# EAGLE design OLIMEXINO-85BC_Rev_A (EAGLE 6.4)
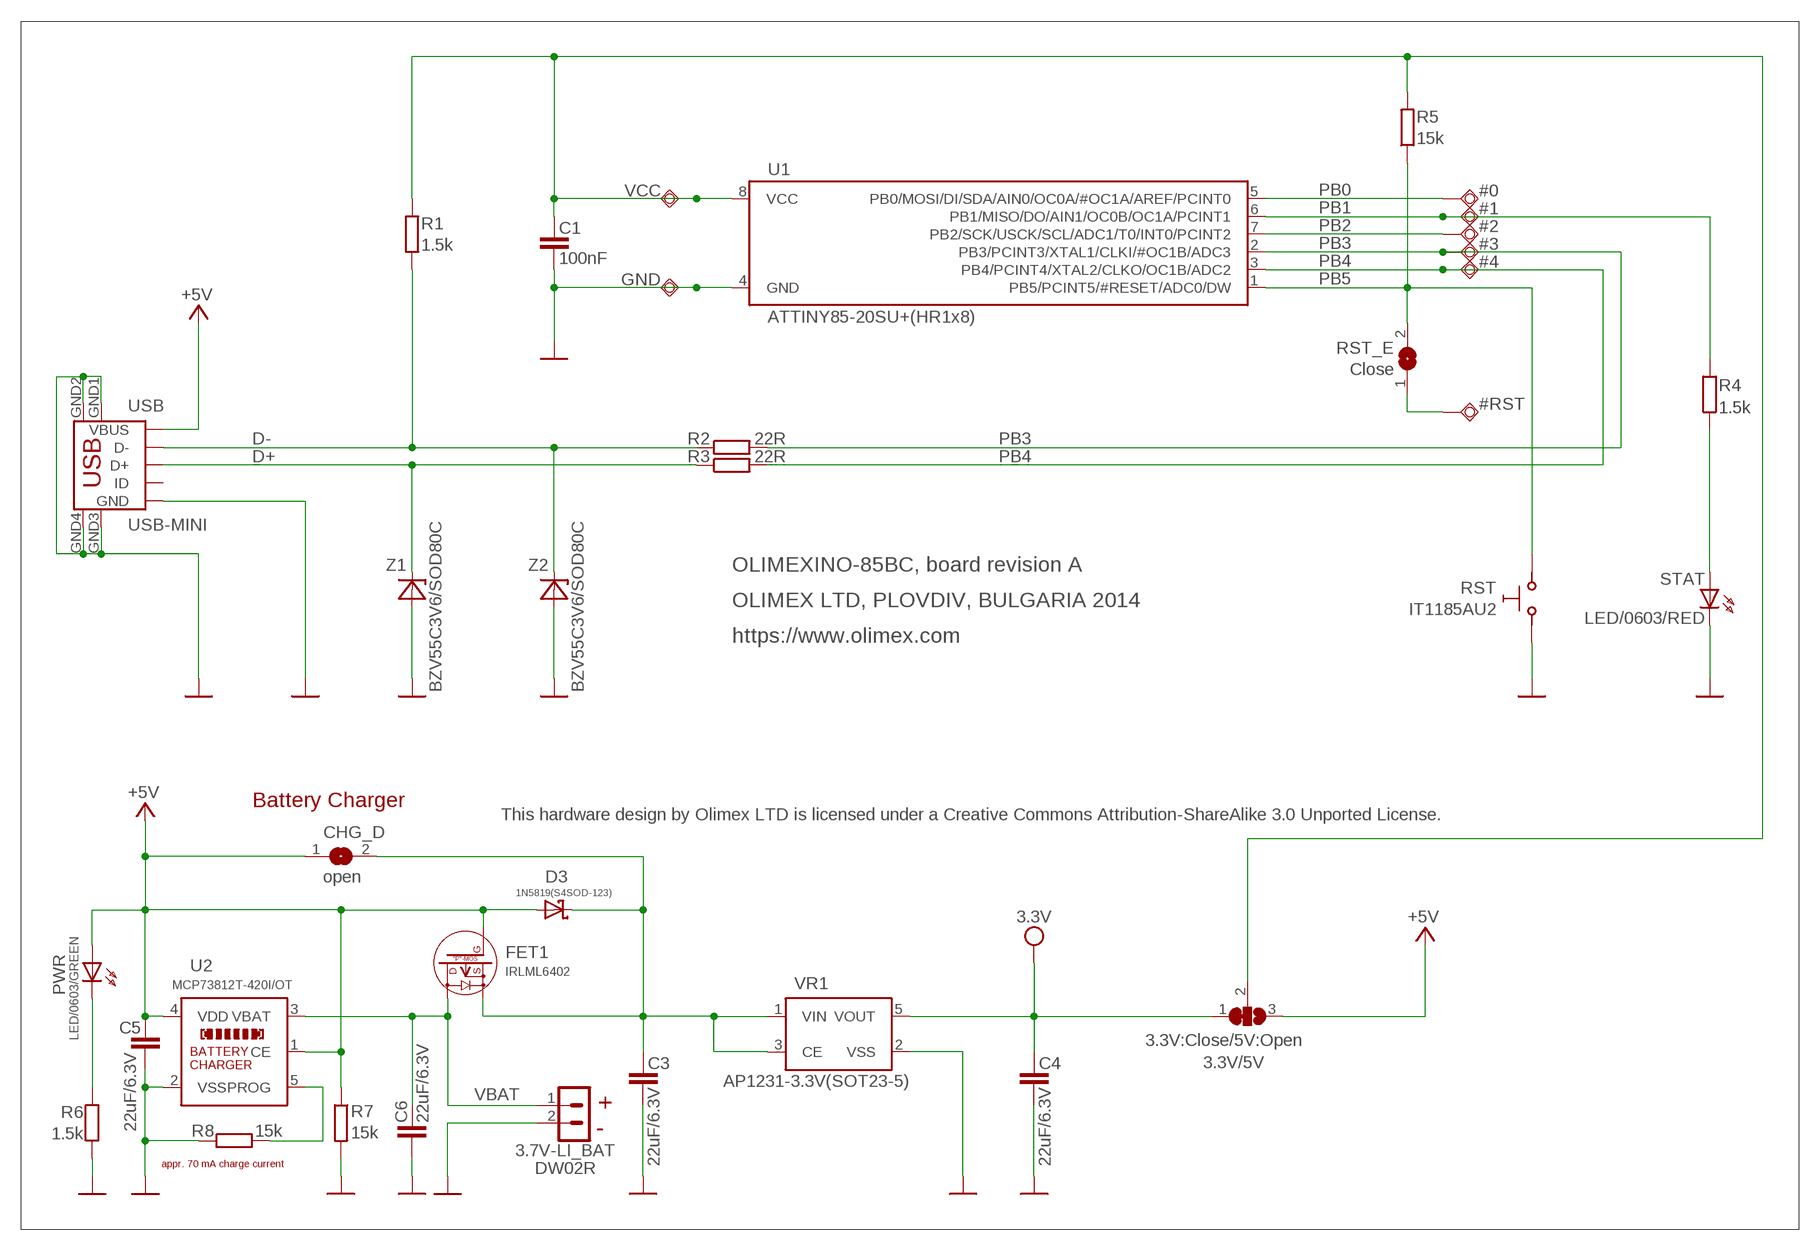
[diagram p0: schematic, sheet 1]

## Parts
3.3V/5V  3.3V:Close/5V:Open  SJ2W3  [SJ_2_SMALL]
3.7V-LI_BAT  DW02R  CON2DW02R  [DW02R]
#0  TESTPAD3  [TEST_PAD40/70/SQUARE]
#1  TESTPAD3  [TEST_PAD40/70/SQUARE]
#2  TESTPAD3  [TEST_PAD40/70/SQUARE]
#3  TESTPAD3  [TEST_PAD40/70/SQUARE]
#4  TESTPAD3  [TEST_PAD40/70/SQUARE]
#RST  TESTPAD3  [TEST_PAD40/70/SQUARE]
C1  100nF  C-EUC0603_DWS  [C0603_DWS]
C3  22uF/6.3V  C-EUC0603_DWS  [C0603_DWS]
C4  22uF/6.3V  C-EUC0603_DWS  [C0603_DWS]
C5  22uF/6.3V  C-EUC0603_DWS  [C0603_DWS]
C6  22uF/6.3V  C-EUC0603_DWS  [C0603_DWS]
CHG_D  open  SJSJ_SMALLER  [SJ_1_SMALLER]
D3  1N5819(S4SOD-123)  SCHOTKKY7.62SS-1N5819(S4SOD-123)  [SOD-123]
FET1  IRLML6402  P-MOS+DIODIRLML6402  [SOT23]
GND  TESTPAD3  [TEST_PAD40/70/SQUARE]
PWR  LED/0603/GREEN  LED0603DWS  [LED-0603]
R1  1.5k  R-EU_R0603_5MIL_DWS  [R0603_5MIL_DWS]
R2  22R  R-EU_R0603_5MIL_DWS  [R0603_5MIL_DWS]
R3  22R  R-EU_R0603_5MIL_DWS  [R0603_5MIL_DWS]
R4  1.5k  R-EU_R0603_5MIL_DWS  [R0603_5MIL_DWS]
R5  15k  R-EU_R0603_5MIL_DWS  [R0603_5MIL_DWS]
R6  1.5k  R-EU_R0603_5MIL_DWS  [R0603_5MIL_DWS]
R7  15k  R-EU_R0603_5MIL_DWS  [R0603_5MIL_DWS]
R8  15k  R-EU_R0603_5MIL_DWS  [R0603_5MIL_DWS]
RST  IT1185AU2  SW-TAKTIT1185AU2  [IT1185AU2]
RST_E  Close  SJSJ_SMALLER  [SJ_1_SMALLER]
STAT  LED/0603/RED  LED0603DWS  [LED-0603]
U1  ATTINY85-20SU+(HR1x8)  ATTINY85-20SU  [SO-8]
U2  MCP73812T-420I/OT  MCP7381XSOT-23-5  [SOT-23-5]
USB  USB-MINI  MINI_USB9  [USB_MINI_9PIN]
VCC  TESTPAD3  [TEST_PAD40/70/SQUARE]
VR1  AP1231-3.3V(SOT23-5)  AP1231-33  [SOT-23-5]
Z1  BZV55C3V6/SOD80C  ZDIOD-SMD  [MINI-MELF]
Z2  BZV55C3V6/SOD80C  ZDIOD-SMD  [MINI-MELF]

## Nets
+5V: 3.3V/5V.3 C5.1 CHG_D.1 D3.A FET1.1(G) PWR.A R7.1 U2.1(CE) U2.4(VDD) USB.VBUS
D+: R3.1 USB.D+ Z1.1(C)
D-: R1.1 R2.1 USB.D- Z2.1(C)
GND [pwr]: 3.7V-LI_BAT.2 C1.2 C3.2 C4.2 C5.2 C6.2 GND.P$1(PP) R6.2 R7.2 R8.1 RST.2 STAT.C U1.4(GND) U2.2(VSS) USB.GND USB.GND1 USB.GND2 USB.GND3 USB.GND4 VR1.2(VSS) Z1.2(A) Z2.2(A)
MCU_VCC [pwr]: 3.3V/5V.2 C1.1 R1.2 R5.2 U1.8(VCC) VCC.P$1(PP)
N$1: #RST.P$1(PP) RST_E.1
N$4: R4.1 STAT.A
N$21: PWR.C R6.1
N$22: R8.2 U2.5(PROG)
PB0: #0.P$1(PP) U1.5(PB0/MOSI/DI/SDA/AIN0/OC0A/#OC1A/AREF/PCINT0)
PB1: #1.P$1(PP) R4.2 U1.6(PB1/MISO/DO/AIN1/OC0B/OC1A/PCINT1)
PB2: #2.P$1(PP) U1.7(PB2/SCK/USCK/SCL/ADC1/T0/INT0/PCINT2)
PB3: #3.P$1(PP) R2.2 U1.2(PB3/PCINT3/XTAL1/CLKI/#OC1B/ADC3)
PB4: #4.P$1(PP) R3.2 U1.3(PB4/PCINT4/XTAL2/CLKO/OC1B/ADC2)
PB5: R5.1 RST.1 RST_E.2 U1.1(PB5/PCINT5/#RESET/ADC0/DW)
VBAT: 3.7V-LI_BAT.1 C6.1 FET1.3(D) U2.3(VBAT)
VCC [pwr]: 3.3V/5V.1 C4.1 VR1.5(VOUT) ; supply symbol labelled 3.3V
VIN: C3.1 CHG_D.2 D3.C FET1.2(S) VR1.1(VIN) VR1.3(CE)
Unconnected: USB.ID

## Notes on the sheet
- OLIMEXINO-85BC, board revision A
- OLIMEX LTD, PLOVDIV, BULGARIA 2014
- https://www.olimex.com
- Battery Charger
- This hardware design by Olimex LTD is licensed under a Creative Commons Attribution-ShareAlike 3.0 Unported License.
- +
- -
- appr. 70 mA charge current

## Library data of the parts
3.3V/5V = jumper:SJ2W: SMD solder JUMPER
3.7V-LI_BAT = Penko:CON2
#0 #1-#4 #RST GND VCC = gogo:TESTPAD: drill 40mils, diameter 70mils
C1 C3-C6 = rcl:C-EU: CAPACITOR, European symbol
CHG_D RST_E = jumper:SJ: SMD solder JUMPER
D3 = gogo:SCHOTKKY7.62SS
FET1 = Penko:P-MOS+DIOD
PWR STAT = DOUBLE-SIDE:LED
R1-R8 = rcl:R-EU_: RESISTOR, European symbol
RST = gogo:SW-TAKT
U1 = OLIMEX_IC:ATTINY85: Atmel 8-bit AVR Microcontroller with 2/4/8K Bytes In-System Programmable Flash Features *High Performance, Low Power AVR® 8-Bit Microcontroller * Advanced RISC Architecture - 120 Powerful Instructions ? Most Single Clock Cycle Execution - 32 x 8 General Purpose Working Registers - Fully Static ...
U2 = OLIMEX_DISCRET:MCP7381X
USB = OLIMEX_CONNECTORS:MINI_USB9
VR1 = OLIMEX_DISCRET:AP1231
Z1 Z2 = gogo:ZDIOD-SMD

## Net classes
0 default: width 0.254 mm, clearance 0.254 mm
1 pwr: width 0.35 mm, clearance 0.25 mm

## Board
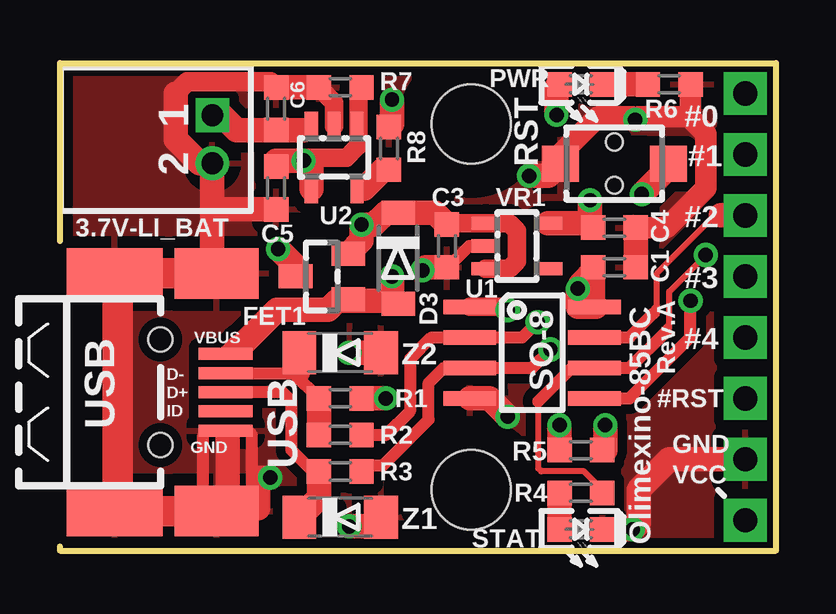
[diagram p1: board, top side]
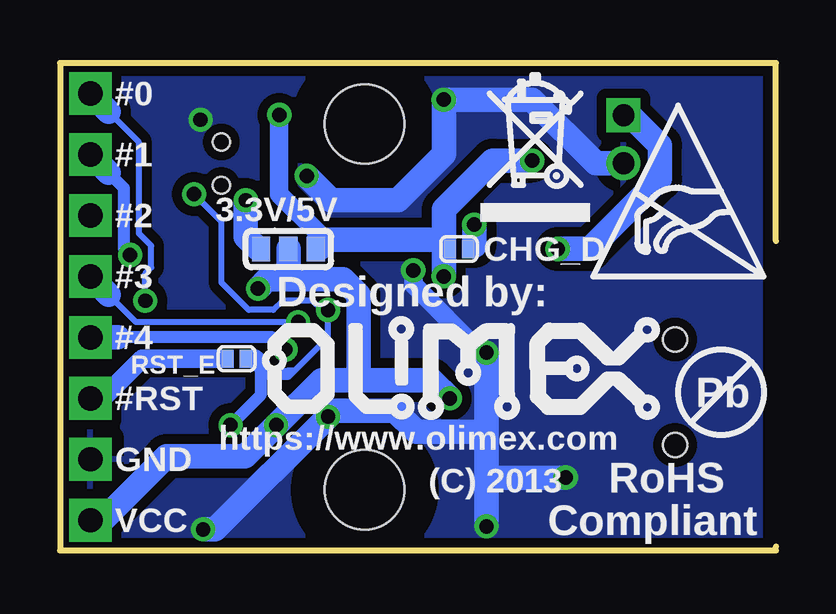
[diagram p2: board, bottom side, seen from below]

Size 29.84 x 20.32 mm. Coordinates in mm from the lower left corner, seen from the top.
Outline: 0,0.17 0,0 29.84,0 29.84,20.32 0,20.32 0,12.91
Copper layers (1+16): Top 0.035mm / dielectric 1.5mm / Bottom 0.035mm
Design rules "default": minimum track width 10mil, minimum drill 0.6mm, track to track 10mil, track to pad 10mil, pad to pad 10mil, via to via 10mil, smd to smd 1mil, copper to edge 10mil, drill to drill 8mil, minimum pad ring 10mil, minimum via ring 8mil, stop-mask expansion 2mil, vias tented up to drill 25mil, thermal gap 20mil
Holes 3.3 mm at 17.14,2.54 17.14,17.78
tRestrict: area 14.6,15.2 to 19.7,20.3; area 14.6,0 to 19.7,5.1; 13 lines
bRestrict: area 14.6,0 to 19.7,5.1; area 14.6,15.2 to 19.7,20.3; 1 lines

### Footprints (pad centres in the part's own frame; a part is rotated, then mirrored left to right if it is on the bottom)
SJ_2_SMALL = smd 0.762 x 1.016: 1 -1.143,0; 2 0,0; 3 1.143,0
DW02R = drill 0.9 square: 1 -1,0 | drill 0.9: 2 1,0
TEST_PAD40/70/SQUARE = drill 1.016 pad 1.778 square: P$1 0,0
C0603_DWS = smd 1.016 x 1.016: 1 -0.889,0; 2 0.889,0
SJ_1_SMALLER = smd 0.508 x 0.762: 1 -0.381,0; 2 0.381,0
SOD-123 = smd 1 x 1.4: A 1.9,0; C -1.9,0
SOT23 = smd 1 x 1.4: 1 -0.95,-1.1; 2 0.95,-1.1; 3 0,1.1
LED-0603 = smd 1.016 x 1.016: A 0.889,0; C -0.889,0
R0603_5MIL_DWS = smd 1.016 x 1.016: 1 -0.889,0; 2 0.889,0
IT1185AU2 = smd 1.55 x 1.5: 1 -2.25,0; 2 2.25,0 | hole 0.7: 0,-0.9; 0,0.9
SO-8 = smd 0.6 x 2.2: 1 -1.905,-2.6; 2 -0.635,-2.6; 3 0.635,-2.6; 4 1.905,-2.6; 5 1.905,2.6; 6 0.635,2.6; 7 -0.635,2.6; 8 -1.905,2.6
SOT-23-5 = smd 0.55 x 1.2: 1 -0.95,-1.3; 2 0,-1.3; 3 0.95,-1.3; 4 0.95,1.3; 5 -0.95,1.3
USB_MINI_9PIN = smd 2.25 x 0.5: D+ 2.706,0; D- 2.706,0.8; GND 2.706,-1.6; ID 2.706,-0.8; VBUS 2.706,1.6 | smd 4 x 2.1: GND1 -1.9,4.95; GND3 -1.9,-4.95 | smd 3.5 x 2.1: GND2 2.35,4.95; GND4 2.35,-4.95 | hole 1: 0,2.2; 0,-2.2
MINI-MELF = smd 1.4 x 1.8: 1 -1.7,0; 2 1.7,0

### Placement (x,y rotation side)
3.3V/5V  20.32,12.57 0 bottom
3.7V-LI_BAT  6.35,17.14 270 top
#0  28.57,19.05 0 top
#1  28.57,16.51 0 top
#2  28.57,13.97 0 top
#3  28.57,11.43 0 top
#4  28.57,8.89 0 top
#RST  28.57,6.35 0 top
C1  23.11,11.81 0 top
C3  16.13,12.7 270 top
C4  23.11,13.46 0 top
C5  9.02,15.11 270 top
C6  9.02,18.41 90 top
CHG_D  13.21,12.57 0 bottom
D3  14.1,12.19 270 top
FET1  10.92,11.43 90 top
GND  28.57,3.81 0 top
PWR  21.72,19.43 180 top
R1  11.68,6.35 0 top
R2  11.68,4.83 0 top
R3  11.68,3.3 0 top
R4  21.72,2.41 0 top
R5  21.72,4.19 180 top
R6  25.4,19.43 0 top
R7  11.68,19.3 180 top
R8  13.72,16.76 270 top
RST  23.11,16.13 180 top
RST_E  22.48,8 0 bottom
STAT  21.72,0.89 180 top
U1  19.68,8.26 270 top
U2  11.43,16.38 180 top
U$1  [RECYCLE_BIN1/8]  12.32,13.72 0 bottom
U$2  [OLIMEX1_V]  3.68,5.33 0 bottom
U$3  [ESD_SYMBOL]  7.62,11.43 0 bottom
U$4  [PB_SMALL]  2.29,6.6 0 bottom
USB  4.19,6.6 0 top
VCC  28.57,1.27 0 top
VR1  19.05,12.7 270 top
Z1  11.68,1.4 0 top
Z2  11.68,8.26 0 top

### Tracks (layer width: path | path; a pad name or v marks a point on that pad's centre or on a via)
+5V  (via drill 0.6)
  Top 0.508: 7.75,8.74 7.75,8.51 7.44,8.2 USB.VBUS 6.9,8.29 7.37,8.76 7.75,8.76 | 12.32,16.76 12.38,16.82 | 12.45,17.68 U2.1
  Top 0.762: 12.38,16.82 12.45,16.89 12.45,17.68 12.45,19.18 R7.1 | 12.32,16.76 11.94,16.38 10.29,16.38 v10.16,16.26
  Top 1.016: D3.A 13.97,10.41 13.84,10.41 | 13.84,10.41 12.09,10.41 FET1.1 11.96,10.41 11.56,10.41 11.18,10.03 9.04,10.03 7.75,8.74 | C5.1 9.02,16.26 v10.16,16.26 10.48,15.94 U2.4 | 13.84,10.41 v13.84,11.43 | v20.7,18.16 20.7,19.3 PWR.A
  Bottom 0.508: 13.84,12.32 CHG_D.1
  Bottom 0.762: 19.05,12.57 3.3V/5V.3 | v20.7,18.16 20.7,14.86 19.05,13.21 19.05,12.95
  Bottom 1.016: v13.84,11.43 13.84,12.32 13.84,12.95 | 19.05,12.57 19.05,12.95 13.84,12.95 | v10.16,16.26 11.81,16.26 13.84,14.22 13.84,12.95
D+
  Top 0.508: USB.D+ 9.27,6.6 9.65,6.22 9.65,4.19 10.54,3.3 R3.1
  Top 1.016: Z1.1 10.79,2.21 R3.1
D-
  Top 0.508: USB.D- 9.74,7.4 | 9.74,7.4 R1.1 | 9.74,7.4 10.03,7.4
  Top 0.762: Z2.1 10.03,8.21 10.03,7.4
  Top 1.016: R1.1 R2.1
GND  (via drill 0.6)
  Top 0.508: 6.99,5 7.82,5 8,4.83 8,1.78 | 6.99,5 USB.GND 6.15,5 5.97,4.83 5.97,1.65 | USB.GND4 6.99,1.65 | 6.99,5 6.99,4.7 | VR1.2 17.07,12.7 16.18,11.81 C3.2
  Top 0.762: USB.GND2 7.05,11.05 | U2.2 11.43,18.67 R7.2
  Top 0.813: C6.2 8.79,19.53 5.31,19.53 4.83,19.05
  Top 0.889: RST.2 20.86,16.52 22.43,18.09 23.86,18.09 v23.98,17.96 24.11,18.09 26.21,18.09 | C4.2 25.27,13.46 26.92,15.11 26.92,17.37 26.21,18.09 | R6.2 26.29,18.16 26.21,18.09
  Top 1.016: 6.99,1.65 6.99,1.78 | 6.99,1.78 6.99,4.7 | Z1.2 13,1.02 v12.06,1.02 | 6.99,1.78 8,1.78 8.26,1.78 8.26,3.05 v8.76,3.05 | U1.4 17.91,6.35 v18.67,5.59 | v12.06,8.26 Z2.2 | STAT.C v23.88,0.89 24.13,1.14 24.13,2.54 25.4,3.81 GND.P$1 | 6.35,14.22 3.7V-LI_BAT.2 5.83,16.14 4.83,17.14 4.83,19.05 | 6.35,14.22 C5.2 | USB.GND2 6.35,11.74 6.35,14.22 | C6.2 R7.2 | R8.1 13.84,17.78 v13.84,18.8 | v15.11,11.68 15.24,11.81 C3.2 | C4.2 C1.2 | RST.2 20.36,15.62 v19.56,15.62
  Top 1.27: 2.41,11.55 USB.GND2 | USB.GND3 2.41,1.65 | 2.41,1.65 5.97,1.65 USB.GND4 | 2.41,11.55 USB.GND1 | 2.41,1.65 2.41,11.55
  Bottom 0.762: v12.06,8.26 12.29,8.26 15.11,11.07 v15.11,11.68
  Bottom 1.016: v8.76,3.05 12.06,3.05 | 12.06,3.05 v12.06,1.02 | 12.06,3.05 12.06,4.95 | 12.06,4.95 v12.06,8.26 | v23.88,0.89 23.37,0.89 v18.67,5.59 18.41,5.84 15.88,5.84 14.99,4.95 12.06,4.95 | v19.56,15.62 18.54,14.61 15.75,14.61 13.84,16.51 v13.84,18.8 10.16,18.8 7.51,16.14 3.7V-LI_BAT.2
  pour Top (isolate 0.406, rank 3): -1,-1 32.72,-1 32.72,21.26 -1,21.26
  pour Bottom (isolate 0.406, rank 3): -2,-2 36.26,-2 36.26,22.26 -2,22.26
MCU_VCC  (via drill 0.6)
  Top 0.762: v21.59,10.92 21.59,11.18 C1.1 22.35,11.81 22.35,10.16
  Top 1.016: R1.2 v13.59,6.35 | U1.8 22.35,10.16 21.59,10.16 v21.59,10.92 | v20.83,5.23 R5.2
  Bottom 1.016: v13.59,6.35 14.35,7.11 17.4,7.11 | VCC.P$1 28.07,1.27 25.4,3.94 22.12,3.94 v20.83,5.23 18.95,7.11 17.4,7.11 | 20.32,11.3 3.3V/5V.2 | 20.32,11.3 18.03,11.3 17.4,10.67 17.4,7.11 | 20.32,11.3 21.21,11.3 v21.59,10.92
N$1
  Bottom 0.508: RST_E.1 22.99,8
  Bottom 0.762: #RST.P$1 28.07,6.35 26.42,8 22.99,8
N$4
  Top 1.016: STAT.A R4.1
N$21
  Top 1.016: PWR.C R6.1
N$22
  Top 0.508: U2.5 12.67,15.08
  Top 1.016: 12.67,15.08 13.46,15.88 R8.2
PB0  (via drill 0.6)
  Top 0.508: U1.5 23.75,6.35 26.29,8.89 v26.29,10.41
  Bottom 0.254: v26.29,10.41 26.29,11.56 26.04,11.81 26.04,12.7 26.54,13.21 26.54,17.02 27.81,18.29
  Bottom 1.016: 27.81,18.29 #0.P$1
PB1  (via drill 0.6)
  Top 0.254: R4.2 22.61,2.54 21.84,3.3 20.07,3.3 19.94,3.43 19.94,6.22 | 25.27,9.14 25.4,9.27 25.4,9.45 | 25.4,9.45 25.4,10.79 v26.92,12.32 | 25.4,9.45 25.27,9.32
  Top 0.508: 19.94,6.22 21.34,7.62 U1.6 23.75,7.62 25.27,9.14
  Bottom 0.508: 27.81,15.75 27.18,15.11 27.18,12.57 v26.92,12.32
  Bottom 1.016: 27.81,15.75 #1.P$1
PB2
  Top 0.254: 27.56,13.97 27.3,13.97 24.89,11.56 24.89,10.21 | 24.77,9.91 24.89,10.03 24.89,10.21 | 24.89,10.21 24.77,10.08
  Top 0.508: U1.7 23.75,8.89 24.77,9.91
  Top 1.016: 27.56,13.97 #2.P$1
PB3  (via drill 0.6)
  Top 0.508: R2.2 13.59,4.83 14.61,5.84 14.61,8 15.49,8.89 U1.2 19.28,8.89 v19.91,9.53
  Bottom 0.254: v19.91,9.53 26.67,9.53 27.81,10.67
  Bottom 1.016: 27.81,10.67 #3.P$1
PB4  (via drill 0.6)
  Top 0.508: R3.2 12.83,3.56 13.46,3.56 15.37,5.46 15.37,6.99 16,7.62 U1.3 19.68,7.62 v20.45,8.38
  Bottom 0.508: v20.45,8.38 20.95,8.89 27.43,8.89
  Bottom 1.016: 27.43,8.89 #4.P$1
PB5  (via drill 0.6)
  Top 0.762: U1.1 18.54,10.16 v18.67,10.03
  Top 1.016: RST.1 25.36,15.97 v24.26,14.86 | R5.1 22.73,4.19 v22.73,5.23
  Bottom 0.254: 20.37,7.37 20.19,7.37 20.07,7.49 | 20.07,7.49 18.67,8.89 v18.67,10.03 18.92,10.03 19.3,10.41 20.57,10.41 20.95,10.03 21.97,10.03 23.11,11.18 23.11,13.72 v24.26,14.86 | 20.07,7.49 20.37,7.49
  Bottom 0.508: 21.46,7.37 20.37,7.37 | 21.46,7.37 21.46,7.75 | 21.97,8 RST_E.2 | 21.46,7.37 21.46,6.5 v22.73,5.23
  Bottom 0.762: 21.46,7.75 21.72,8 21.97,8
VBAT  (via drill 0.6)
  Top 0.508: U2.3 10.32,17.53 10.16,17.53
  Top 1.016: 10.16,17.53 C6.1 7.37,17.53 6.75,18.14 3.7V-LI_BAT.1 | FET1.3 9.82,11.84 v9.09,12.57
  Bottom 1.016: v9.09,12.57 7.75,12.57 4.83,15.49 4.83,16.89 6.08,18.14 3.7V-LI_BAT.1
VCC  (via drill 0.6)
  Top 1.016: v22.1,14.61 22.1,13.59 22.23,13.59 | 22.23,13.59 C4.1 | VR1.5 22.23,13.65 22.23,13.59
  Bottom 0.762: 3.3V/5V.1 21.59,12.57
  Bottom 1.016: 21.59,12.57 22.1,13.08 v22.1,14.61
VIN  (via drill 0.6)
  Top 0.762: C3.1 16.13,13.65 VR1.1 18.73,13.65 19.05,13.34 19.05,12.06 18.73,11.75 VR1.3
  Top 1.016: FET1.2 12.57,12.93 v12.57,13.59 13.08,13.59 13.58,14.09 D3.C 15.63,14.09 C3.1
  Bottom 0.508: CHG_D.2 12.7,12.57 12.57,12.7
  Bottom 1.016: v12.57,13.59 12.57,12.7

### Text on the board
tNames: Rev.A | Olimexino-85BC
bNames: Designed by: | https://www.olimex.com | RoHS | (C) 2013 | Compliant